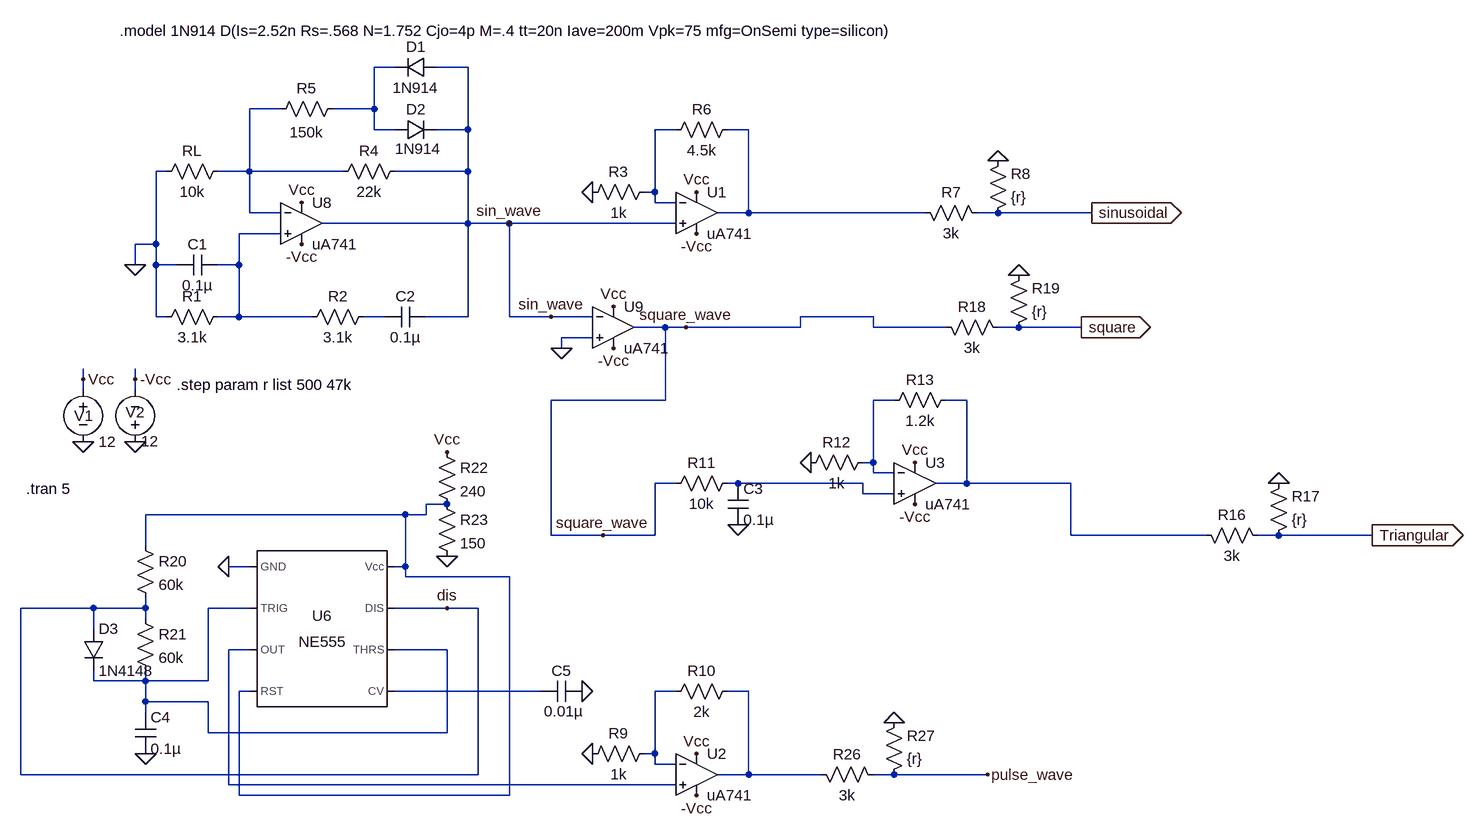
[diagram p0: schematic highfc.asc]
highfc.asc, the LTspice schematic file:
Version 4
SHEET 1 2612 1476
WIRE 576 -448 544 -448
WIRE 688 -448 640 -448
WIRE 400 -384 352 -384
WIRE 544 -384 544 -448
WIRE 544 -384 480 -384
WIRE 544 -352 544 -384
WIRE 576 -352 544 -352
WIRE 688 -352 688 -448
WIRE 688 -352 640 -352
WIRE 1008 -352 976 -352
WIRE 1120 -352 1088 -352
WIRE 224 -288 208 -288
WIRE 352 -288 352 -384
WIRE 352 -288 304 -288
WIRE 496 -288 352 -288
WIRE 688 -288 688 -352
WIRE 688 -288 576 -288
WIRE 976 -256 976 -352
WIRE 976 -256 960 -256
WIRE 976 -240 976 -256
WIRE 1008 -240 976 -240
WIRE 352 -224 352 -288
WIRE 400 -224 352 -224
WIRE 1120 -224 1120 -352
WIRE 1120 -224 1072 -224
WIRE 1392 -224 1120 -224
WIRE 1504 -224 1472 -224
WIRE 1648 -224 1504 -224
WIRE 688 -208 688 -288
WIRE 688 -208 464 -208
WIRE 752 -208 688 -208
WIRE 1008 -208 752 -208
WIRE 400 -192 336 -192
WIRE 208 -176 208 -288
WIRE 208 -176 176 -176
WIRE 176 -144 176 -176
WIRE 208 -144 208 -176
WIRE 240 -144 208 -144
WIRE 336 -144 336 -192
WIRE 336 -144 304 -144
WIRE 208 -64 208 -144
WIRE 224 -64 208 -64
WIRE 336 -64 336 -144
WIRE 336 -64 304 -64
WIRE 448 -64 336 -64
WIRE 560 -64 528 -64
WIRE 688 -64 688 -208
WIRE 688 -64 624 -64
WIRE 752 -64 752 -208
WIRE 816 -64 752 -64
WIRE 880 -64 816 -64
WIRE 1312 -64 1200 -64
WIRE 992 -48 944 -48
WIRE 1024 -48 992 -48
WIRE 1200 -48 1200 -64
WIRE 1200 -48 1024 -48
WIRE 1312 -48 1312 -64
WIRE 1424 -48 1312 -48
WIRE 1536 -48 1504 -48
WIRE 1632 -48 1536 -48
WIRE 880 -32 832 -32
WIRE 832 -16 832 -32
WIRE 96 32 96 16
WIRE 176 32 176 16
WIRE 96 48 96 32
WIRE 176 48 176 32
WIRE 992 64 992 -48
WIRE 992 64 816 64
WIRE 1344 64 1312 64
WIRE 1456 64 1424 64
WIRE 1312 160 1312 64
WIRE 1312 160 1296 160
WIRE 1312 176 1312 160
WIRE 1344 176 1312 176
WIRE 1008 192 976 192
WIRE 1104 192 1088 192
WIRE 1296 192 1104 192
WIRE 1456 192 1456 64
WIRE 1456 192 1408 192
WIRE 1616 192 1456 192
WIRE 1296 208 1296 192
WIRE 1344 208 1296 208
WIRE 656 224 624 224
WIRE 592 240 192 240
WIRE 624 240 624 224
WIRE 624 240 592 240
WIRE 816 272 816 64
WIRE 896 272 816 272
WIRE 976 272 976 192
WIRE 976 272 896 272
WIRE 1616 272 1616 192
WIRE 1824 272 1616 272
WIRE 1936 272 1904 272
WIRE 2080 272 1936 272
WIRE 192 288 192 240
WIRE 352 320 320 320
WIRE 592 320 592 240
WIRE 592 320 576 320
WIRE 592 336 592 320
WIRE 752 336 592 336
WIRE 112 384 0 384
WIRE 192 384 192 368
WIRE 192 384 112 384
WIRE 352 384 288 384
WIRE 656 384 576 384
WIRE 704 384 656 384
WIRE 192 400 192 384
WIRE 112 416 112 384
WIRE 352 448 320 448
WIRE 656 448 576 448
WIRE 112 496 112 480
WIRE 192 496 192 480
WIRE 192 496 112 496
WIRE 288 496 288 384
WIRE 288 496 192 496
WIRE 352 512 336 512
WIRE 800 512 576 512
WIRE 1008 512 976 512
WIRE 1120 512 1088 512
WIRE 192 528 192 496
WIRE 288 528 192 528
WIRE 192 544 192 528
WIRE 288 576 288 528
WIRE 656 576 656 448
WIRE 656 576 288 576
WIRE 976 608 976 512
WIRE 976 608 960 608
WIRE 976 624 976 608
WIRE 1008 624 976 624
WIRE 0 640 0 384
WIRE 704 640 704 384
WIRE 704 640 0 640
WIRE 1120 640 1120 512
WIRE 1120 640 1072 640
WIRE 1232 640 1120 640
WIRE 1344 640 1312 640
WIRE 1488 640 1344 640
WIRE 320 656 320 448
WIRE 1008 656 320 656
WIRE 336 672 336 512
WIRE 752 672 752 336
WIRE 752 672 336 672
FLAG 96 128 0
FLAG 176 128 0
FLAG 96 32 Vcc
FLAG 176 32 -Vcc
FLAG 432 -240 Vcc
FLAG 432 -176 -Vcc
FLAG 176 -144 0
FLAG 1040 -256 Vcc
FLAG 1040 -192 -Vcc
FLAG 880 -256 0
FLAG 1504 -304 0
FLAG 912 -80 Vcc
FLAG 912 -16 -Vcc
FLAG 832 -16 0
FLAG 1648 -224 sinusoidal
IOPIN 1648 -224 Out
FLAG 1632 -48 square
IOPIN 1632 -48 Out
FLAG 1536 -128 0
FLAG 656 384 dis
FLAG 192 608 0
FLAG 656 304 0
FLAG 656 144 Vcc
FLAG 864 512 0
FLAG 1344 560 0
FLAG 1488 640 pulse_wave
FLAG 752 -208 sin_wave
FLAG 1024 -48 square_wave
FLAG 816 -64 sin_wave
FLAG 896 272 square_wave
FLAG 1936 192 0
FLAG 2080 272 Triangular
IOPIN 2080 272 Out
FLAG 320 320 0
FLAG 1040 608 Vcc
FLAG 1040 672 -Vcc
FLAG 880 608 0
FLAG 1104 256 0
FLAG 1376 160 Vcc
FLAG 1376 224 -Vcc
FLAG 1216 160 0
SYMBOL voltage 96 32 R0
WINDOW 0 -14 56 Left 2
WINDOW 123 0 0 Left 0
WINDOW 39 0 0 Left 0
SYMATTR InstName V1
SYMATTR Value 12
SYMBOL voltage 176 144 R180
WINDOW 0 -15 61 Left 2
WINDOW 3 -36 17 Left 2
WINDOW 123 0 0 Left 0
WINDOW 39 0 0 Left 0
SYMATTR InstName V2
SYMATTR Value 12
SYMBOL res 320 -80 R90
WINDOW 0 0 56 VBottom 2
WINDOW 3 32 56 VTop 2
SYMATTR InstName R1
SYMATTR Value 3.1k
SYMBOL res 544 -80 R90
WINDOW 0 0 56 VBottom 2
WINDOW 3 32 56 VTop 2
SYMATTR InstName R2
SYMATTR Value 3.1k
SYMBOL res 320 -304 R90
WINDOW 0 0 56 VBottom 2
WINDOW 3 32 56 VTop 2
SYMATTR InstName RL
SYMATTR Value 10k
SYMBOL res 592 -304 R90
WINDOW 0 0 56 VBottom 2
WINDOW 3 32 56 VTop 2
SYMATTR InstName R4
SYMATTR Value 22k
SYMBOL res 496 -400 R90
WINDOW 0 0 56 VBottom 2
WINDOW 3 36 56 VTop 2
SYMATTR InstName R5
SYMATTR Value 150k
SYMBOL cap 304 -160 R90
WINDOW 0 0 32 VBottom 2
WINDOW 3 32 32 VTop 2
SYMATTR InstName C1
SYMATTR Value 0.1µ
SYMBOL cap 624 -80 R90
WINDOW 0 0 32 VBottom 2
WINDOW 3 32 32 VTop 2
SYMATTR InstName C2
SYMATTR Value 0.1µ
SYMBOL diode 640 -464 R90
WINDOW 0 0 32 VBottom 2
WINDOW 3 32 32 VTop 2
SYMATTR InstName D1
SYMATTR Value 1N914
SYMBOL diode 576 -336 R270
WINDOW 0 32 32 VTop 2
WINDOW 3 2 36 VBottom 2
SYMATTR InstName D2
SYMATTR Value 1N914
SYMBOL res 976 -272 R90
WINDOW 0 0 56 VBottom 2
WINDOW 3 32 56 VTop 2
SYMATTR InstName R3
SYMATTR Value 1k
SYMBOL res 1104 -368 R90
WINDOW 0 0 56 VBottom 2
WINDOW 3 32 56 VTop 2
SYMATTR InstName R6
SYMATTR Value 4.5k
SYMBOL res 1488 -208 M270
WINDOW 0 32 56 VTop 2
WINDOW 3 0 56 VBottom 2
SYMATTR InstName R7
SYMATTR Value 3k
SYMBOL res 1488 -208 M180
WINDOW 0 36 76 Left 2
WINDOW 3 36 40 Left 2
SYMATTR InstName R8
SYMATTR Value {r}
SYMBOL res 1520 -32 M270
WINDOW 0 32 56 VTop 2
WINDOW 3 0 56 VBottom 2
SYMATTR InstName R18
SYMATTR Value 3k
SYMBOL res 1520 -32 M180
WINDOW 0 36 76 Left 2
WINDOW 3 36 40 Left 2
SYMATTR InstName R19
SYMATTR Value {r}
SYMBOL Misc\\NE555 464 416 R0
SYMATTR InstName U6
SYMBOL res 176 272 R0
SYMATTR InstName R20
SYMATTR Value 60k
SYMBOL res 176 384 R0
SYMATTR InstName R21
SYMATTR Value 60k
SYMBOL cap 176 544 R0
SYMATTR InstName C4
SYMATTR Value 0.1µ
SYMBOL res 640 128 R0
SYMATTR InstName R22
SYMATTR Value 240
SYMBOL res 640 208 R0
SYMATTR InstName R23
SYMATTR Value 150
SYMBOL cap 864 496 R90
WINDOW 0 0 32 VBottom 2
WINDOW 3 31 28 VTop 2
SYMATTR InstName C5
SYMATTR Value 0.01µ
SYMBOL res 1328 656 M270
WINDOW 0 32 56 VTop 2
WINDOW 3 0 56 VBottom 2
SYMATTR InstName R26
SYMATTR Value 3k
SYMBOL res 1328 656 M180
WINDOW 0 36 76 Left 2
WINDOW 3 36 40 Left 2
SYMATTR InstName R27
SYMATTR Value {r}
SYMBOL res 1920 288 M270
WINDOW 0 32 56 VTop 2
WINDOW 3 0 56 VBottom 2
SYMATTR InstName R16
SYMATTR Value 3k
SYMBOL res 1920 288 M180
WINDOW 0 36 76 Left 2
WINDOW 3 36 40 Left 2
SYMATTR InstName R17
SYMATTR Value {r}
SYMBOL OpAmps\\uA741 432 -272 R0
SYMATTR InstName U8
SYMBOL OpAmps\\uA741 1040 -288 R0
SYMATTR InstName U1
SYMBOL OpAmps\\uA741 912 -112 R0
SYMATTR InstName U9
SYMBOL diode 96 416 R0
SYMATTR InstName D3
SYMATTR Value 1N4148
SYMBOL res 976 592 R90
WINDOW 0 0 56 VBottom 2
WINDOW 3 32 56 VTop 2
SYMATTR InstName R9
SYMATTR Value 1k
SYMBOL res 1104 496 R90
WINDOW 0 0 56 VBottom 2
WINDOW 3 32 56 VTop 2
SYMATTR InstName R10
SYMATTR Value 2k
SYMBOL OpAmps\\uA741 1040 576 R0
SYMATTR InstName U2
SYMBOL res 1104 176 R90
WINDOW 0 0 56 VBottom 2
WINDOW 3 32 56 VTop 2
SYMATTR InstName R11
SYMATTR Value 10k
SYMBOL cap 1088 192 R0
SYMATTR InstName C3
SYMATTR Value 0.1µ
SYMBOL res 1312 144 R90
WINDOW 0 0 56 VBottom 2
WINDOW 3 32 56 VTop 2
SYMATTR InstName R12
SYMATTR Value 1k
SYMBOL res 1440 48 R90
WINDOW 0 0 56 VBottom 2
WINDOW 3 32 56 VTop 2
SYMATTR InstName R13
SYMATTR Value 1.2k
SYMBOL OpAmps\\uA741 1376 128 R0
SYMATTR InstName U3
TEXT 8 200 Left 2 !.tran 5
TEXT 152 -504 Left 2 !.model 1N914 D(Is=2.52n Rs=.568 N=1.752 Cjo=4p M=.4 tt=20n Iave=200m Vpk=75 mfg=OnSemi type=silicon)
TEXT 240 40 Left 2 !.step param r list 500 47k

The netlist it stands for:
* highfc.asc
V1 Vcc 0 12
V2 0 -Vcc 12
R1 N005 0 3.1k
R2 N006 N005 3.1k
RL N002 0 10k
R4 sin_wave N002 22k
R5 N001 N002 150k
C1 N005 0 0.1µ
C2 sin_wave N006 0.1µ
D1 sin_wave N001 1N914
D2 N001 sin_wave 1N914
R3 N003 0 1k
R6 N004 N003 4.5k
R7 sinusoidal N004 3k
R8 sinusoidal 0 {r}
R18 square square_wave 3k
R19 square 0 {r}
XU6 0 N011 N012 N010 N013 N011 dis N010 NE555  ; pins GND TRIG OUT RST CV THRS DIS Vcc
R20 N010 dis 60k
R21 dis N011 60k
C4 N011 0 0.1µ
R22 Vcc N010 240
R23 N010 0 150
C5 0 N013 0.01µ
R26 pulse_wave N015 3k
R27 pulse_wave 0 {r}
R16 Triangular N008 3k
R17 Triangular 0 {r}
XU8 N005 N002 Vcc -Vcc sin_wave uA741  ; pins In+ In- V+ V- OUT
XU1 sin_wave N003 Vcc -Vcc N004 uA741  ; pins In+ In- V+ V- OUT
XU9 0 sin_wave Vcc -Vcc square_wave uA741  ; pins In+ In- V+ V- OUT
D3 dis N011 1N4148
R9 N014 0 1k
R10 N015 N014 2k
XU2 N012 N014 Vcc -Vcc N015 uA741  ; pins In+ In- V+ V- OUT
R11 N009 square_wave 10k
C3 N009 0 0.1µ
R12 N007 0 1k
R13 N008 N007 1.2k
XU3 N009 N007 Vcc -Vcc N008 uA741  ; pins In+ In- V+ V- OUT
.model D D
.lib standard.dio
.tran 5
.model 1N914 D(Is=2.52n Rs=.568 N=1.752 Cjo=4p M=.4 tt=20n Iave=200m Vpk=75 mfg=OnSemi type=silicon)
.step param r list 500 47k
.lib NE555.sub
.backanno
.end